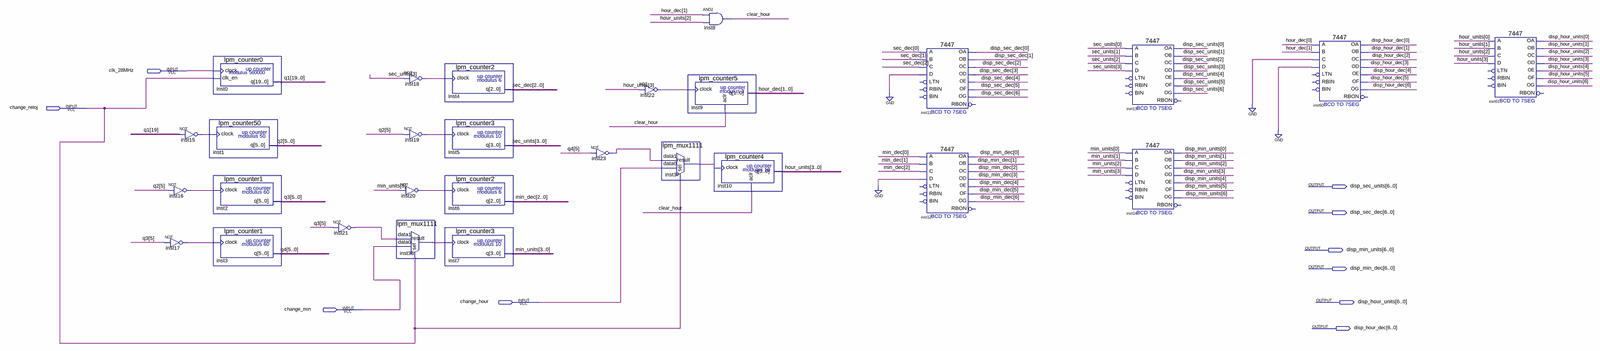
[diagram p0: schematic sheet, whole]
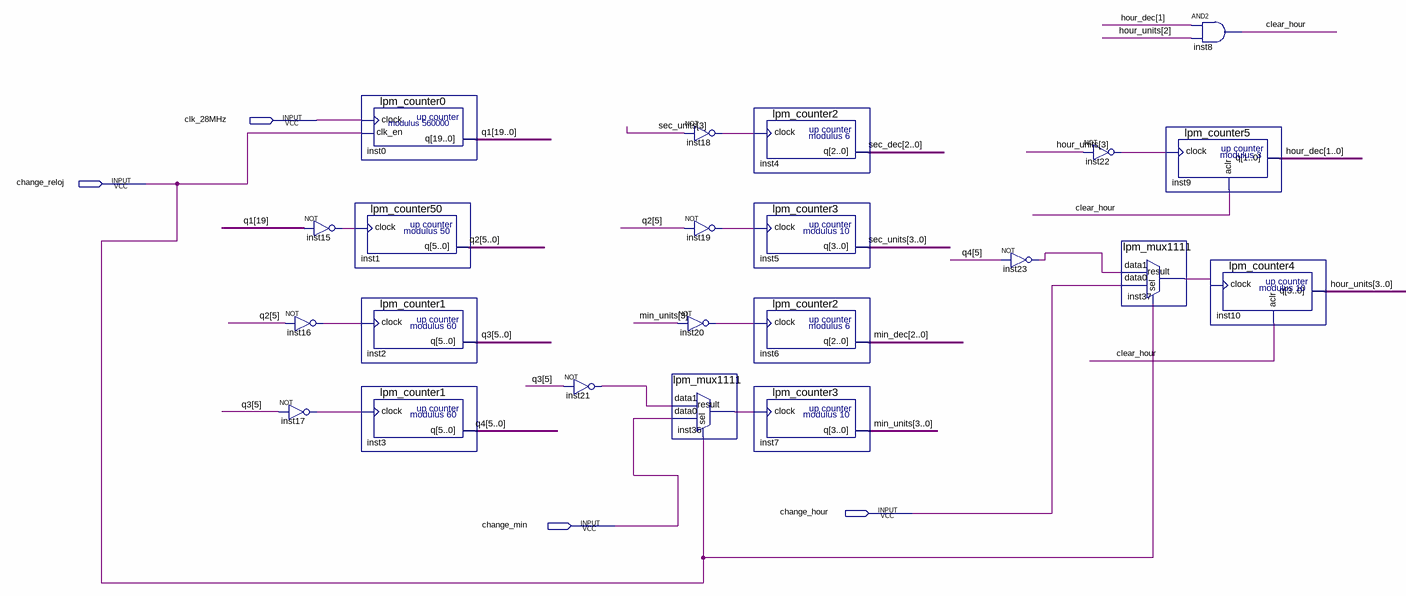
[diagram p1: schematic sheet, left part]
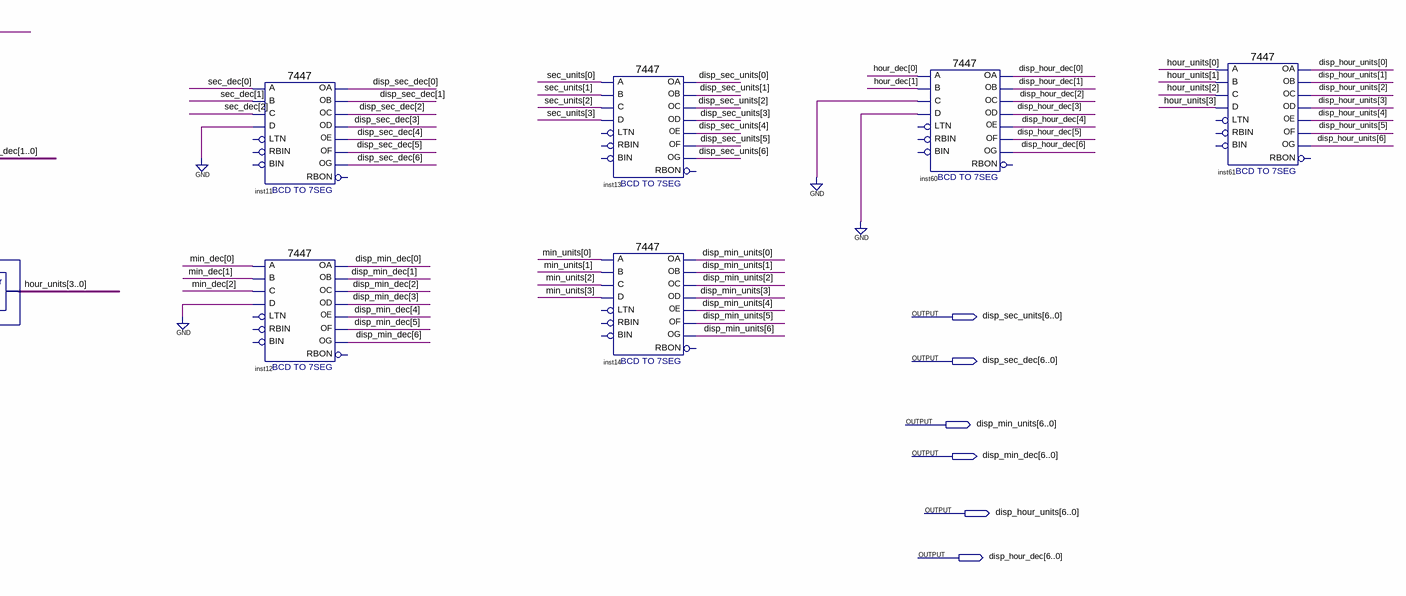
[diagram p2: schematic sheet, right part]
// Quartus schematic Hora.bdf as structural Verilog: 28 symbols, 10 pins
module Hora (
  input  clk_28MHz,
  input  change_reloj,
  input  change_hour,
  input  change_min,
  output [6:0] disp_sec_units,
  output [6:0] disp_sec_dec,
  output [6:0] disp_min_units,
  output [6:0] disp_min_dec,
  output [6:0] disp_hour_units,
  output [6:0] disp_hour_dec
);

  wire clear_hour, inst15_out, inst16_out, inst17_out, inst18_out, inst19_out, inst20_out, inst21_out,
       inst22_out, inst23_out, inst36_result, inst37_result;
  wire [1:0] hour_dec;
  wire [2:0] min_dec, sec_dec;
  wire [3:0] hour_units, min_units, sec_units;
  wire [5:0] q2, q3, q4;
  wire [19:0] q1;

  not inst16 (inst16_out, q2[5]);
  not inst17 (inst17_out, q3[5]);
  not inst15 (inst15_out, q1[19]);
  lpm_counter0 inst0 (.clock(clk_28MHz), .clk_en(change_reloj), .q(q1));
  lpm_counter50 inst1 (.clock(inst15_out), .q(q2));
  lpm_counter1 inst2 (.clock(inst16_out), .q(q3));
  lpm_counter1 inst3 (.clock(inst17_out), .q(q4));
  not inst21 (inst21_out, q3[5]);
  not inst18 (inst18_out, sec_units[3]);
  not inst19 (inst19_out, q2[5]);
  not inst20 (inst20_out, min_units[3]);
  lpm_mux1111 inst36 (.data1(inst21_out), .data0(change_min), .sel(change_reloj), .result(inst36_result));
  lpm_counter2 inst4 (.clock(inst18_out), .q(sec_dec));
  lpm_counter3 inst5 (.clock(inst19_out), .q(sec_units));
  lpm_counter2 inst6 (.clock(inst20_out), .q(min_dec));
  lpm_counter3 inst7 (.clock(inst36_result), .q(min_units));
  not inst23 (inst23_out, q4[5]);
  not inst22 (inst22_out, hour_units[3]);
  lpm_mux1111 inst37 (.data1(inst23_out), .data0(change_hour), .sel(change_reloj), .result(inst37_result));
  and inst8 (clear_hour, hour_dec[1], hour_units[2]);
  lpm_counter5 inst9 (.clock(inst22_out), .aclr(clear_hour), .q(hour_dec));
  lpm_counter4 inst10 (.clock(inst37_result), .aclr(clear_hour), .q(hour_units));
  \7447  inst11 (
    .B(sec_dec[1]), .C(sec_dec[2]), .D(1'b0), .A(sec_dec[0]), .OB(disp_sec_dec[1]), .OC(disp_sec_dec[2]),
    .OE(disp_sec_dec[4]), .OD(disp_sec_dec[3]), .OF(disp_sec_dec[5]), .OG(disp_sec_dec[6]),
    .OA(disp_sec_dec[0]));  // open: LTN, RBIN, BIN, RBON
  \7447  inst12 (
    .B(min_dec[1]), .C(min_dec[2]), .D(1'b0), .A(min_dec[0]), .OB(disp_min_dec[1]), .OC(disp_min_dec[2]),
    .OE(disp_min_dec[4]), .OD(disp_min_dec[3]), .OF(disp_min_dec[5]), .OG(disp_min_dec[6]),
    .OA(disp_min_dec[0]));  // open: LTN, RBIN, BIN, RBON
  \7447  inst13 (
    .B(sec_units[1]), .C(sec_units[2]), .D(sec_units[3]), .A(sec_units[0]), .OB(disp_sec_units[1]),
    .OC(disp_sec_units[2]), .OE(disp_sec_units[4]), .OD(disp_sec_units[3]), .OF(disp_sec_units[5]),
    .OG(disp_sec_units[6]), .OA(disp_sec_units[0]));  // open: LTN, RBIN, BIN, RBON
  \7447  inst14 (
    .B(min_units[1]), .C(min_units[2]), .D(min_units[3]), .A(min_units[0]), .OB(disp_min_units[1]),
    .OC(disp_min_units[2]), .OE(disp_min_units[4]), .OD(disp_min_units[3]), .OF(disp_min_units[5]),
    .OG(disp_min_units[6]), .OA(disp_min_units[0]));  // open: LTN, RBIN, BIN, RBON
  \7447  inst60 (
    .B(hour_dec[1]), .C(1'b0), .D(1'b0), .A(hour_dec[0]), .OB(disp_hour_dec[1]), .OC(disp_hour_dec[2]),
    .OE(disp_hour_dec[4]), .OD(disp_hour_dec[3]), .OF(disp_hour_dec[5]), .OG(disp_hour_dec[6]),
    .OA(disp_hour_dec[0]));  // open: LTN, RBIN, BIN, RBON
  \7447  inst61 (
    .B(hour_units[1]), .C(hour_units[2]), .D(hour_units[3]), .A(hour_units[0]), .OB(disp_hour_units[1]),
    .OC(disp_hour_units[2]), .OE(disp_hour_units[4]), .OD(disp_hour_units[3]), .OF(disp_hour_units[5]),
    .OG(disp_hour_units[6]), .OA(disp_hour_units[0]));  // open: LTN, RBIN, BIN, RBON
endmodule
